# EAGLE schematic untitled (EAGLE 9.5.2)
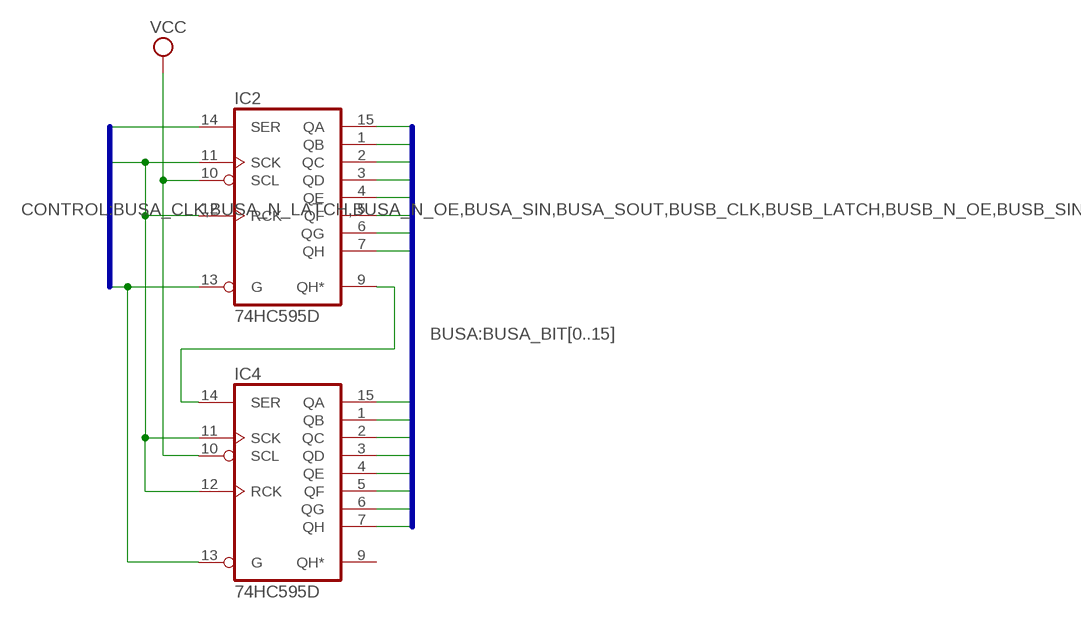
[diagram p0: schematic, sheet 1]

## Parts
IC2  74HC595D  [SO16]
IC4  74HC595D  [SO16]

## Nets
BUSA_BIT0: IC2.15(QA)
BUSA_BIT1: IC2.1(QB)
BUSA_BIT2: IC2.2(QC)
BUSA_BIT3: IC2.3(QD)
BUSA_BIT4: IC2.4(QE)
BUSA_BIT5: IC2.5(QF)
BUSA_BIT6: IC2.6(QG)
BUSA_BIT7: IC2.7(QH)
BUSA_BIT8: IC4.15(QA)
BUSA_BIT9: IC4.1(QB)
BUSA_BIT10: IC4.2(QC)
BUSA_BIT11: IC4.3(QD)
BUSA_BIT12: IC4.4(QE)
BUSA_BIT13: IC4.5(QF)
BUSA_BIT14: IC4.6(QG)
BUSA_BIT15: IC4.7(QH)
BUSA_CLK: IC2.11(SCK) IC2.12(RCK) IC4.11(SCK) IC4.12(RCK)
BUSA_N_OE: IC2.13(G) IC4.13(G)
BUSA_SIN: IC2.14(SER)
N$1: IC2.9(QH*) IC4.14(SER)
VCC: IC2.10(SCL) IC4.10(SCL)
Unconnected: IC4.9(QH*)

## Buses
BUSA:BUSA_BIT[0..15]
CONTROL:BUSA_CLK,BUSA_N_LATCH,BUSA_N_OE,BUSA_SIN,BUSA_SOUT,BUSB_CLK,BUSB_LATCH,BUSB_N_OE,BUSB_SIN,BUSB_SOUT

## Power pins joined to a net without a drawn wire
GND: IC2.8(GND) IC4.8(GND)
VCC: IC2.16(VCC) IC4.16(VCC)

## Library data of the parts
IC2 IC4 = 74xx-eu:74*595: 8-bit SHIFT REGISTER, output latch